# EAGLE design X15-Conversion (EAGLE 9.6.2)

## Sheet 1 of 2
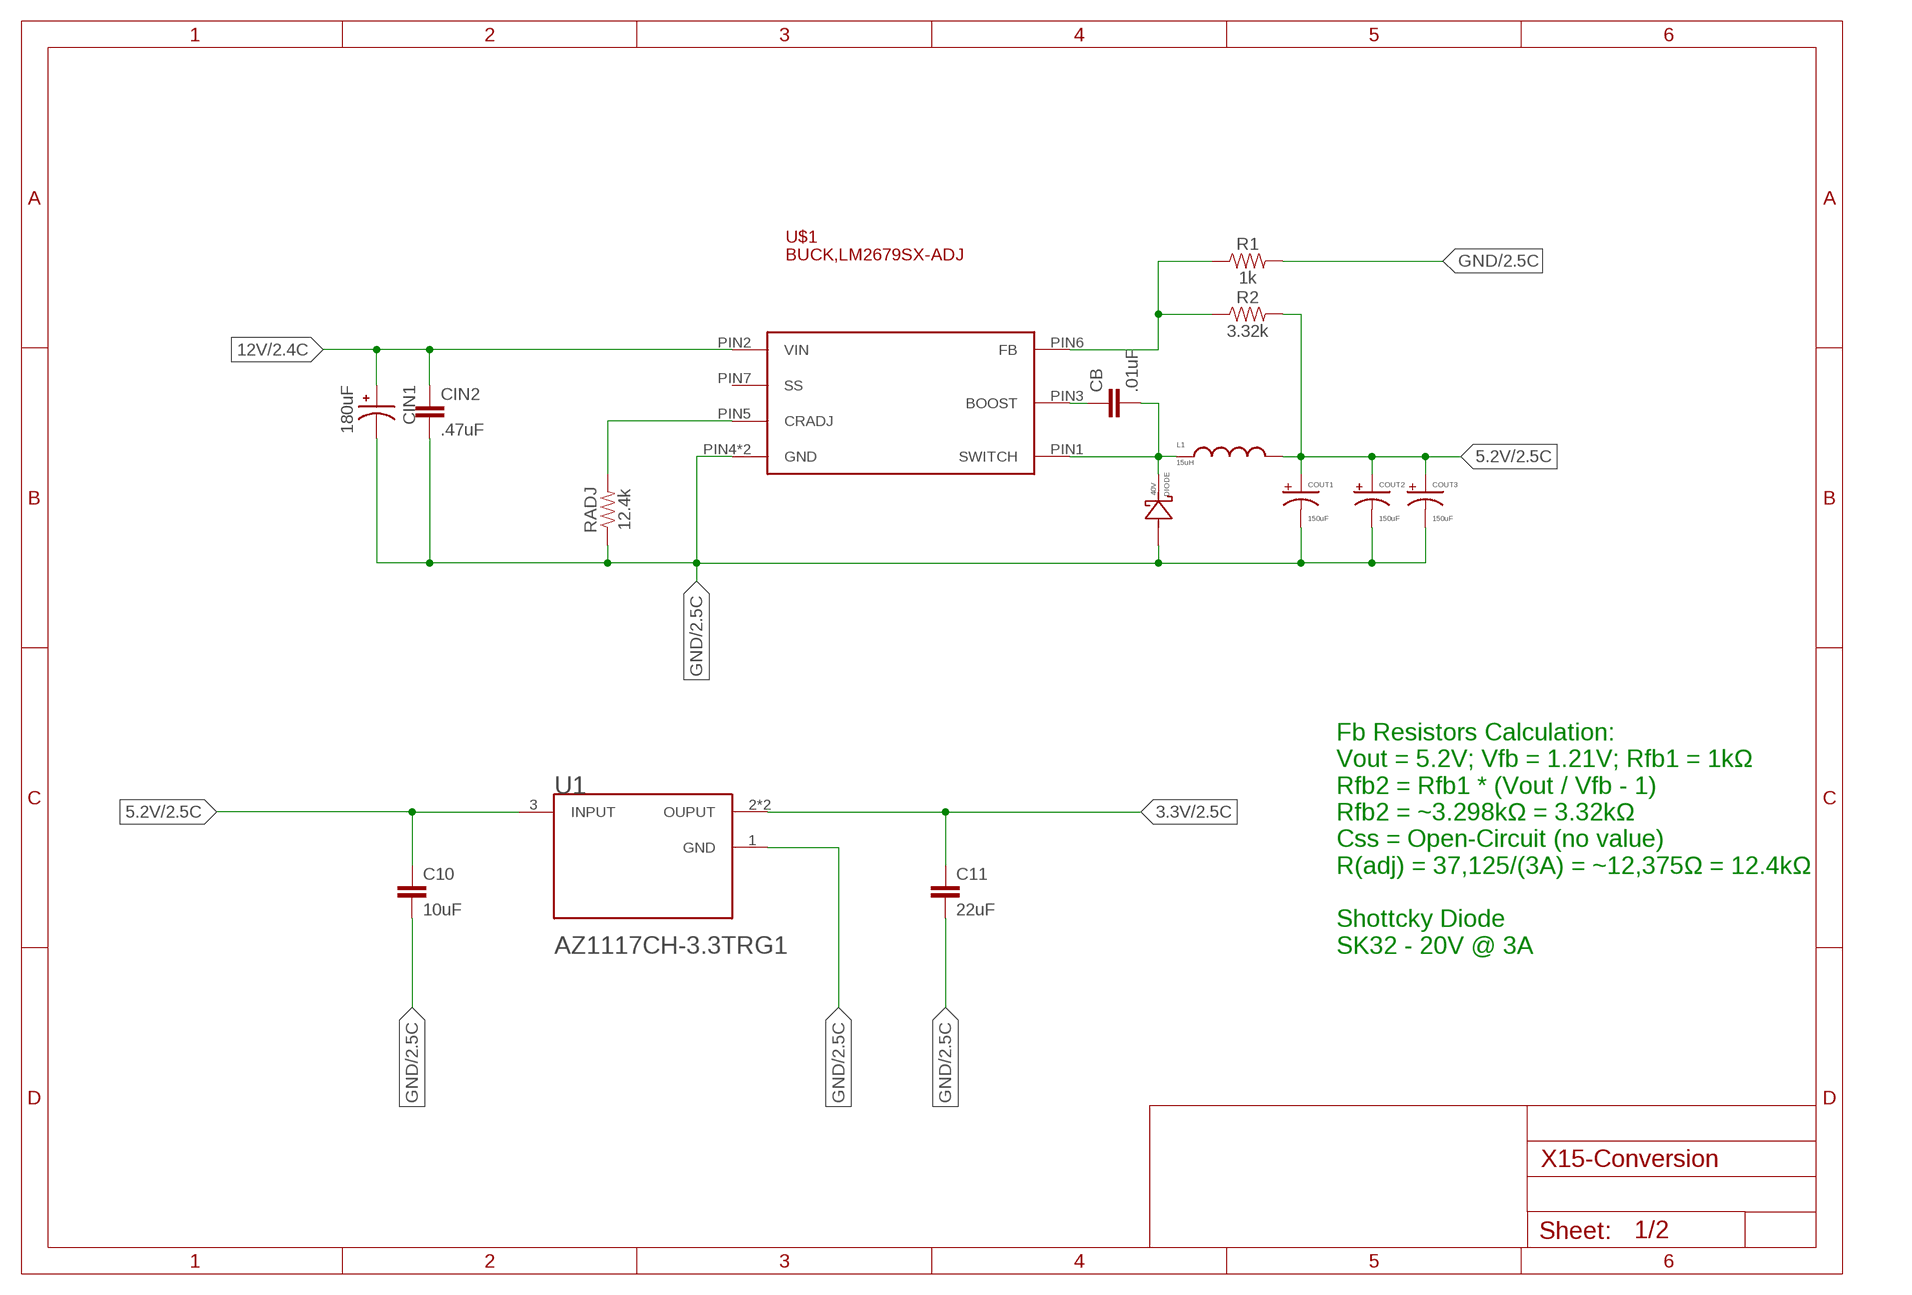
[diagram p0: schematic, sheet 1]

### Parts
C10  10uF  4.7PF-0603-50V-5%  [0603]
C11  22uF  4.7PF-0603-50V-5%  [0603]
CB  .01uF  4.7PF-0603-50V-5%  [0603]
CIN1  180uF  EEEFKE181XSP  [CAP_EEEFKE181XSP]
CIN2  .47uF  4.7PF-0603-50V-5%  [0603]
COUT1  150uF  C-TANTALUM(10UF_150UF)  [2917(7343-31-METRIC)]
COUT2  150uF  C-TANTALUM(10UF_150UF)  [2917(7343-31-METRIC)]
COUT3  150uF  C-TANTALUM(10UF_150UF)  [2917(7343-31-METRIC)]
DIODE  40V  CDBG520-G  [DO214AC]
L1  15uH  HCMA1305  [HCMA1305]
R1  1k  2.0KOHM-0603-1/10W-5%  [0603]
R2  3.32k  2.0KOHM-0603-1/10W-5%  [0603]
RADJ  12.4k  2.0KOHM-0603-1/10W-5%  [0603]
U1  LINEAR,AZ1117CR-3.3TRG1DIODES_AZ1117CH-3.3TRG1_0_0  [LINEAR,AZ1117CR-3.3TRG1]
U$1  BUCK,LM2679SX-ADJ  [BUCK,LM2679SX-ADJ]

### Nets
3.3V: C11.1 U1.2(OUPUT) U1.4(OUPUT) ; also sheet 2
5.2V: C10.1 COUT1.+ COUT2.+ COUT3.+ L1.2 R2.2 U1.3(INPUT) ; also sheet 2
12V: CIN1.1 CIN2.1 U$1.PIN2(VIN) ; also sheet 2
BOOST: CB.1 U$1.PIN3(BOOST)
CRADJ: RADJ.2 U$1.PIN5(CRADJ)
FB: R1.1 R2.1 U$1.PIN6(FB)
GND: C10.2 C11.2 CIN1.2 CIN2.2 COUT1.- COUT2.- COUT3.- DIODE.A R1.2 RADJ.1 U1.1(GND) U$1.PIN4(GND) U$1.PIN8(GND) ; also sheet 2
SWITCH: CB.2 DIODE.C L1.1 U$1.PIN1(SWITCH)
Unconnected: U$1.PIN7(SS)

### Notes on the sheet
- Fb Resistors Calculation: 
  Vout = 5.2V; Vfb = 1.21V; Rfb1 = 1kΩ 
  Rfb2 = Rfb1 * (Vout / Vfb - 1) 
  Rfb2 = ~3.298kΩ = 3.32kΩ
  Css = Open-Circuit (no value)
  R(adj) = 37,125/(3A) = ~12,375Ω = 12.4kΩ
  
  Shottcky Diode
  SK32 - 20V @ 3A

## Sheet 2 of 2
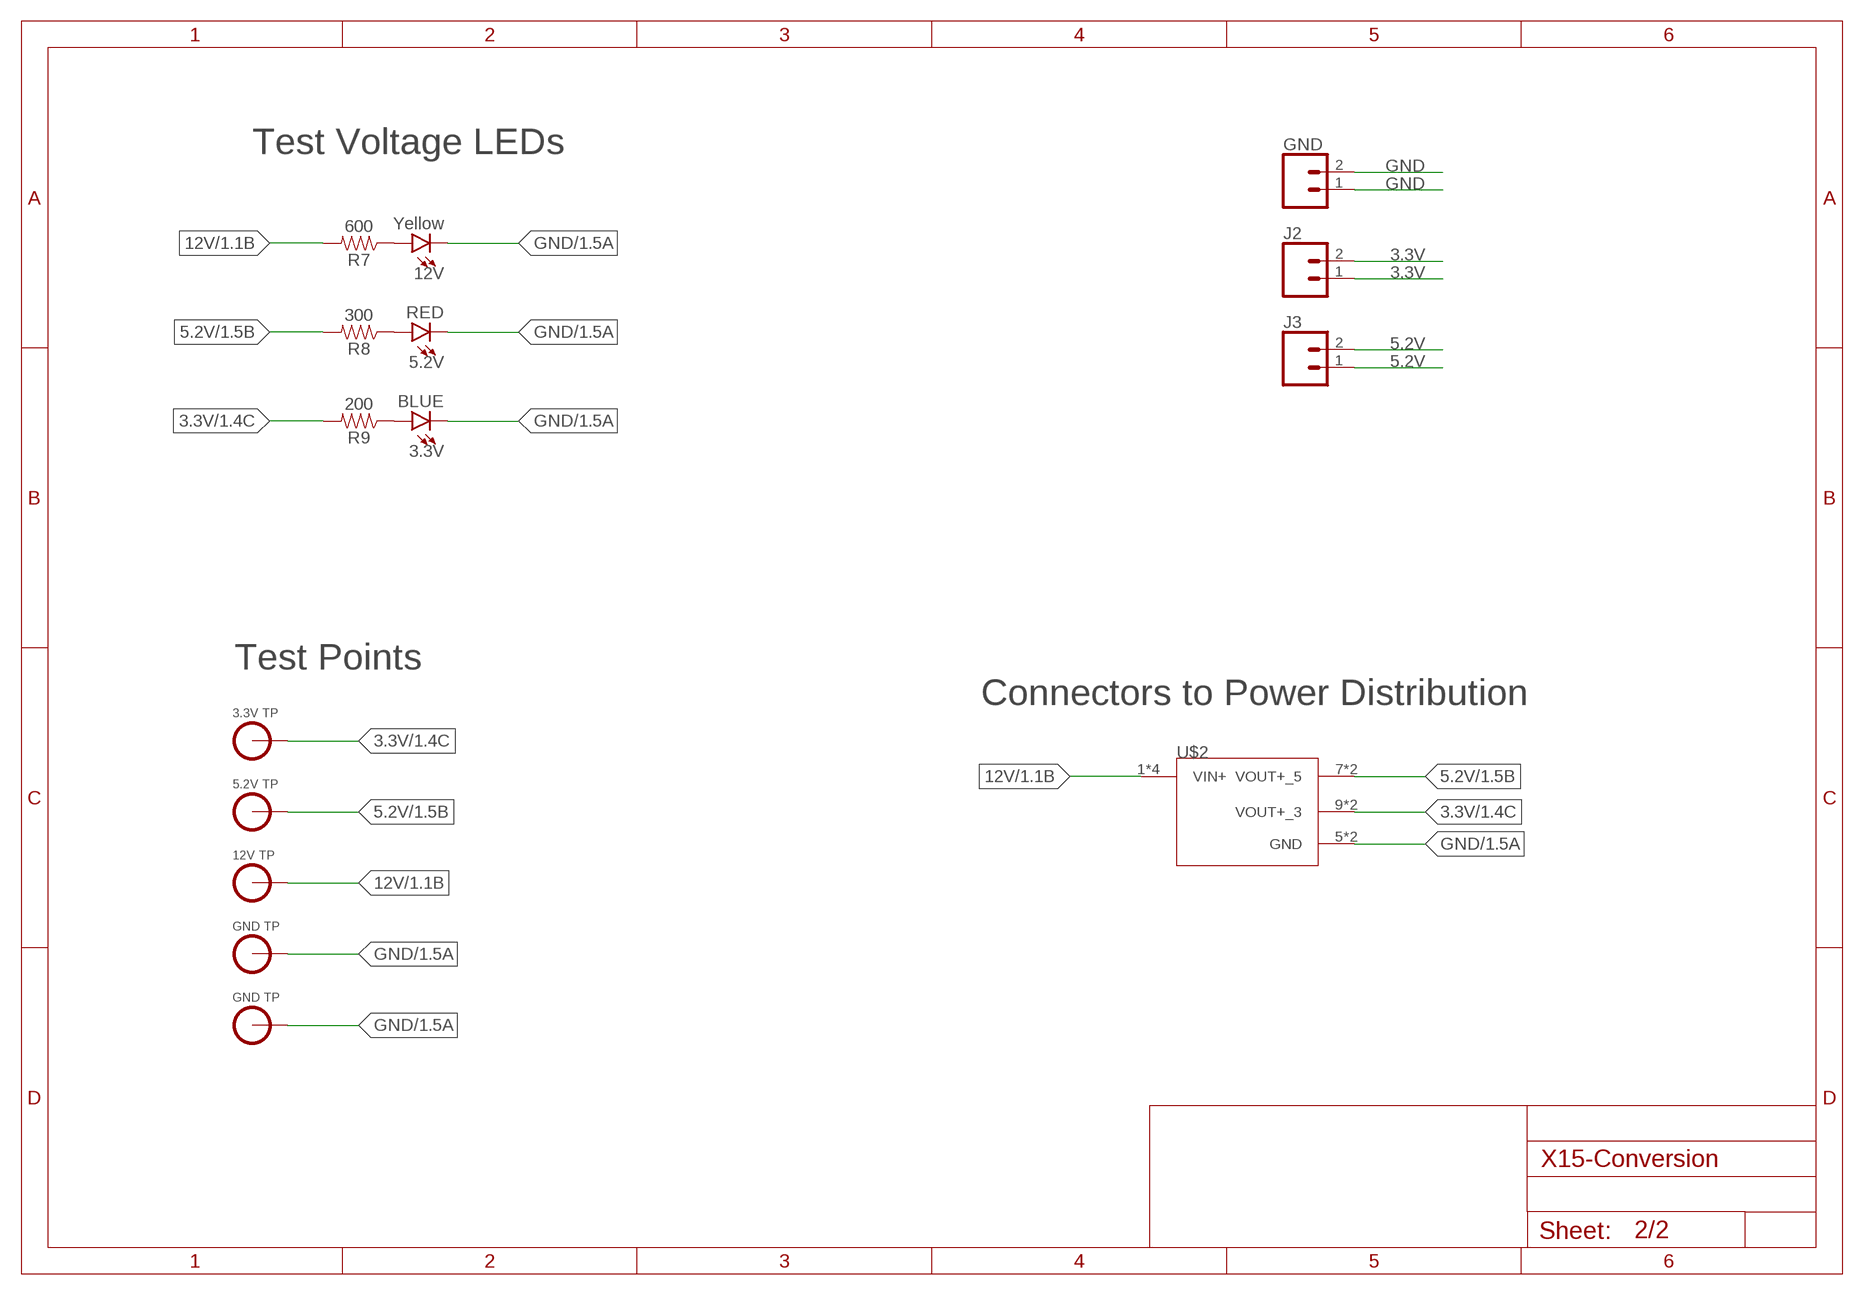
[diagram p1: schematic, sheet 2]

### Parts
3.3V  BLUE  LED-BLUE0603  [LED-0603]
5.2V  RED  LED-RED0603  [LED-0603]
12V  Yellow  LED-YELLOW0603  [LED-0603]
GND  CONN_02  [1X02]
J2  CONN_02  [1X02]
J3  CONN_02  [1X02]
R7  600  20OHM-0603-1/10W-1%  [0603]
R8  300  20OHM-0603-1/10W-1%  [0603]
R9  200  20OHM-0603-1/10W-1%  [0603]
U$2  CONVERSION-DISTRIBUTION  [TSW-105-05-G-S(C-D)]
U$8  3.3V_TESTPOINT  [3.3V_TESTPOINT]
U$9  5.2V_TESTPOINT  [5.2V_TESTPOINT]
U$10  12V_TESTPOINT  [12V_TESTPOINT]
U$11  GND_TESTPOINT  [GND_TESTPOINT]
U$12  GND_TESTPOINT  [GND_TESTPOINT]

### Nets
3.3V: J2.1 J2.2 R9.2 U$2.9(VOUT+_3) U$2.10(VOUT+_3) U$8.3.3V ; also sheet 1
5.2V: J3.1 J3.2 R8.2 U$2.7(VOUT+_5) U$2.8(VOUT+_5) U$9.5.2V ; also sheet 1
12V: R7.2 U$2.1(VIN+) U$2.2(VIN+) U$2.3(VIN+) U$2.4(VIN+) U$10.12V ; also sheet 1
GND: 3.3V.C 5.2V.C 12V.C GND.1 GND.2 U$2.5(GND) U$2.6(GND) U$11.GND U$12.GND ; also sheet 1
N$8: 12V.A R7.1
N$9: 5.2V.A R8.1
N$10: 3.3V.A R9.1

### Notes on the sheet
- Test Voltage LEDs
- Test Points
- Connectors to Power Distribution

## Library data of the parts
3.3V = SparkFun-LED:LED-BLUE: Blue SMD LED Used in manufacturing of various products at SparkFun Packages: 0603 - SMD 0603 package [Product Link] <http://www.digikey.com/product-detail/en/SMLE12BC7TT86/511-1589-2-ND/1641808> 1206 - SMD1206 package [Product Link] <http://www.digikey.com/product-detail/en/lite-on-inc/LTST-C150TBKT/160-1643-1-ND/573584> SparkFun Products: ESP8266 Thing-Dev Board <https://www.sparkfun.com/products/13711> RedBoard <https://www.sparkfun.com/products/12757>; PROD_ID: DIO-08575
5.2V = SparkFun-LED:LED-RED: Red SMD LED Used in manufacturing of most products at SparkFun Packages: 0603 - SMD 0603 package [Product Link] <http://docs.avagotech.com/docs/AV02-0551EN> 0603 SMART - SMD 0603 SMART package ( more efficient and expensive)[Product Link] <http://www.osram-os.com/Graphics/XPic2/00077099_0.pdf> 1206 - SMD1206 package [Product Link] <https://www.sparkfun.com/datasheets/DevTools/LilyPad/Q150OVS4.pdff> SparkFun Products: Pro Mini 328 -5V <https://www.sparkfun.com/products/821> RedBoard <https://www.sparkfun.com/products/12757> IOIO-OTG <https://www.sparkfun.com/products/13613>; PROD_ID: DIO-00819
12V = SparkFun-LED:LED-YELLOW: Yellow SMD LED Used in manufacturing several products at SparkFun. Packages: 0603 - SMD 0603 package[Product Link] <http://www.kingbrightusa.com/product.asp?catalog_name=LED&product_id=APT1608SYCK> 0603 -SMART - SMART SMD 0603 package (more efficient/more expensive) [Product Link] <http://www.osram-os.com/osram_os/en/products/product-catalog/led-light-emitting-diodes/smartled-0603/ly-l29k/index.jsp> LilyPad - SMD1206 package[Product Datasheet] <https://www.sparkfun.com/datasheets/DevTools/LilyPad/Q150YUS4.pdf> SparkFun Products: Blynk Board <https://www.sparkfun.com/products/13794> IOIO-OTG <https://www.sparkfun.com/products/13613> XBee Explorer Serial <https://www.sparkfun.com/products/13225>; PROD_ID: DIO-09003
C10 C11 CB CIN2 = SparkFun-Capacitors:4.7PF: 4.7pF ceramic capacitors A capacitor is a passive two-terminal electrical component used to store electrical energy temporarily in an electric field.; PROD_ID: CAP-07880; VALUE: 4.7pF
CIN1 = X15-Conversion-Parts-Library:EEEFKE181XSP; DESCRIPTION: 180µF 25V Aluminum Electrolytic Capacitors Radial, Can - SMD 340mOhm @ 100kHz 2000 Hrs @ 105°C; DIGI-KEY_PART_NUMBER: P18956TR-ND; MF: Panasonic; MP: EEEFKE181XSP; PACKAGE: RADIAL-2 Panasonic
COUT1-COUT3 = X15-Conversion-Parts-Library:C-TANTALUM(10UF_150UF)
DIODE = X15-Conversion-Parts-Library:CDBG520-G
GND J2 J3 = SparkFun-Connectors:CONN_02: Multi connection point. Often used as Generic Header-pin footprint for 0.1 inch spaced/style header connections On any of the 0.1 inch spaced packages, you can populate with these: Break Away Headers - Straight <https://www.sparkfun.com/products/116> (PRT-00116) Break Away Male Headers - Right Angle <https://www.sparkfun.com/products/553> (PRT-00553) Female Headers <https://www.sparkfun.com/products/115> (PRT-00115) Break Away Headers - Machine Pin <https://www.sparkfun.com/products/117> (PRT-00117) Break Away Female Headers - Swiss Machine Pin <https://www.sparkfun.com/products/743> (PRT-00743) For SCREWTERMINALS and SPRING TERMINALS visit here: Screw Terimnals on SparkFun.com <https://www.sparkfun.com/search/results?term=Screw+Terminals> (5mm/3.5mm/2.54mm spacing) This device is also useful as a general connection point to wire up your design to another part of your project. Our various solder wires solder well into these plated through hole pads. Hook-Up Wire - Assortment (Stranded, 22 AWG) <https://www.sparkfun.com/products/11375> (PRT-11375) Hook-Up Wire - Assortment (Solid Core, 22 AWG) <https://www.sparkfun.com/products/11367> (PRT-11367) View the entire wire category on our website here <https://www.sparkfun.com/categories/141> Special notes: Molex polarized connector foot print use with: PRT-08233 with associated crimp pins and housings. 2.54_SCREWTERM for use with PRT-10571. 3.5mm Screw Terminal footprints for PRT-08084 5mm Screw Terminal footprints for use with PRT-08432
L1 = X15-Conversion-Parts-Library:HCMA1305: Eaton HCMA1305-150-R Inductor
R1 R2 RADJ = SparkFun-Resistors:2.0KOHM: 2kΩ resistor A resistor is a passive two-terminal electrical component that implements electrical resistance as a circuit element. Resistors act to reduce current flow, and, at the same time, act to lower voltage levels within circuits. - Wikipedia; PROD_ID: RES-08296; VALUE: 2.0k
R7-R9 = SparkFun-Resistors:20OHM: RES-07862; PROD_ID: RES-07862; VALUE: 20
U1 = X15-Conversion-Parts-Library:LINEAR,AZ1117CR-3.3TRG1: 1.35A 3.3V LDO Reg. Current Limit SOT223 Check availability <https://pricing.snapeda.com/parts/AZ1117CH-3.3TRG1/Diodes%20Inc./view-part?ref=eda>; AVAILABILITY: In Stock; DESCRIPTION: Linear Voltage Regulator IC Positive Fixed 1 Output 1A SOT-223-3; MF: Diodes Inc.; MP: AZ1117CH-3.3TRG1; PACKAGE: SOT-223 Diodes Inc.; PRICE: None; PURCHASE-URL: https://pricing.snapeda.com/search/part/AZ1117CH-3.3TRG1/?ref=eda
U$1 = X15-Conversion-Parts-Library:BUCK,LM2679SX-ADJ
U$2 = X15-Conversion-Parts-Library:CONVERSION-DISTRIBUTION
U$8 = X15-Conversion-Parts-Library:3.3V_TESTPOINT
U$9 = X15-Conversion-Parts-Library:5.2V_TESTPOINT
U$10 = X15-Conversion-Parts-Library:12V_TESTPOINT
U$11 U$12 = X15-Conversion-Parts-Library:GND_TESTPOINT

## Board
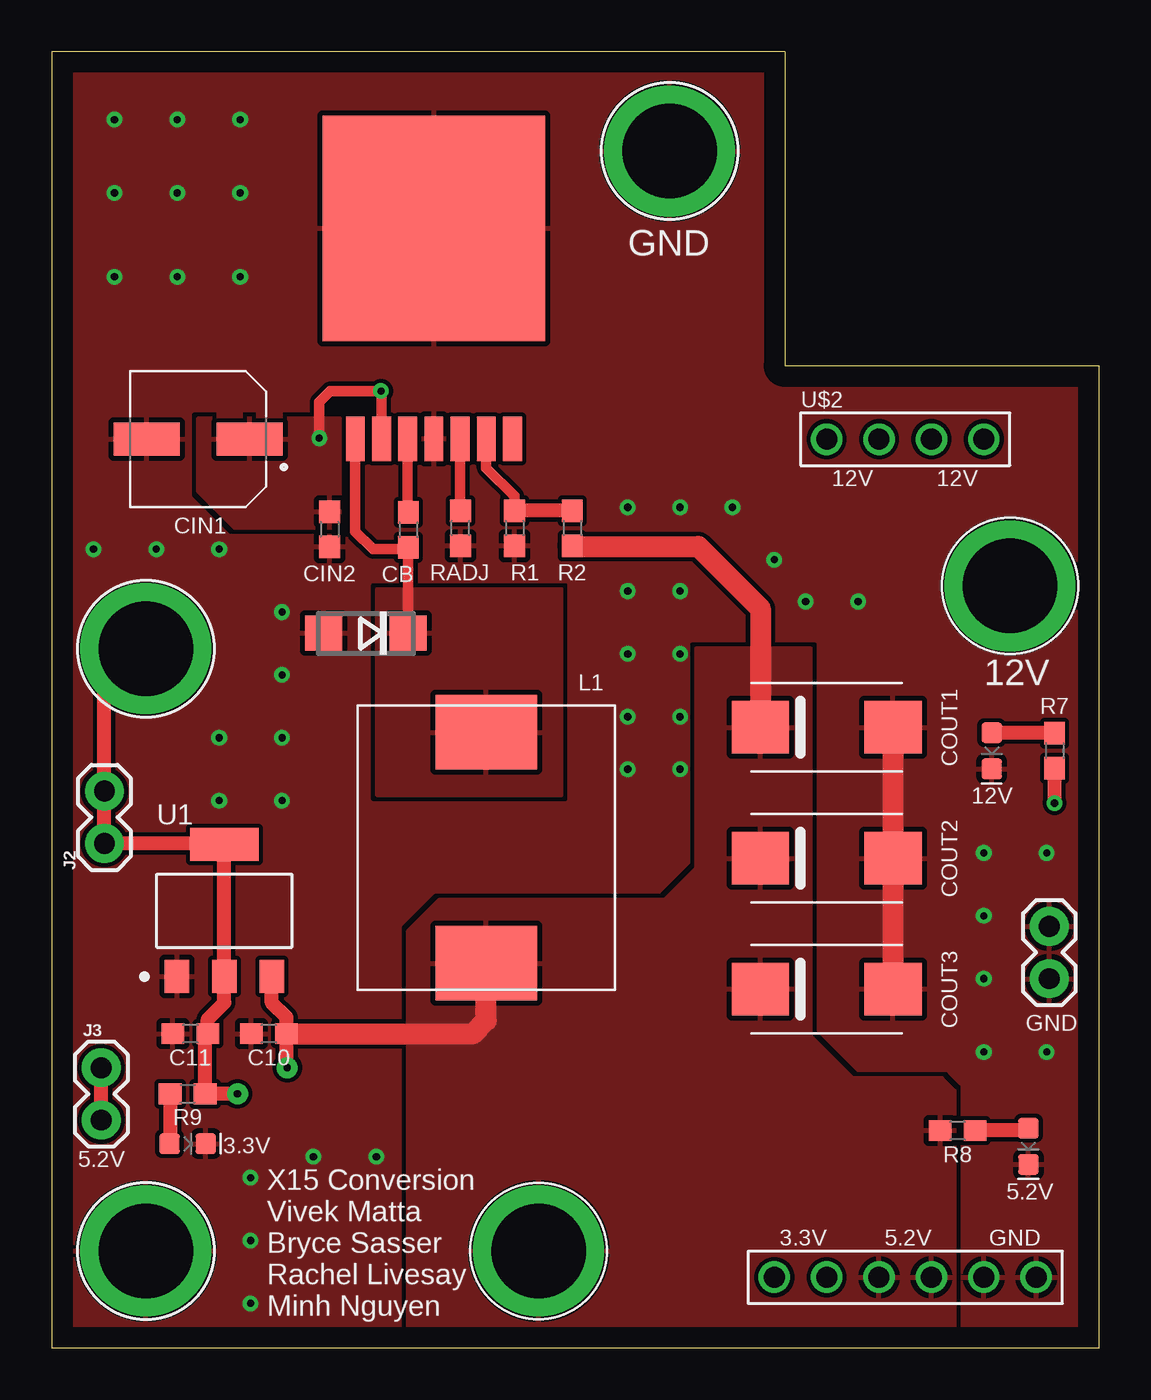
[diagram p2: board, top side]
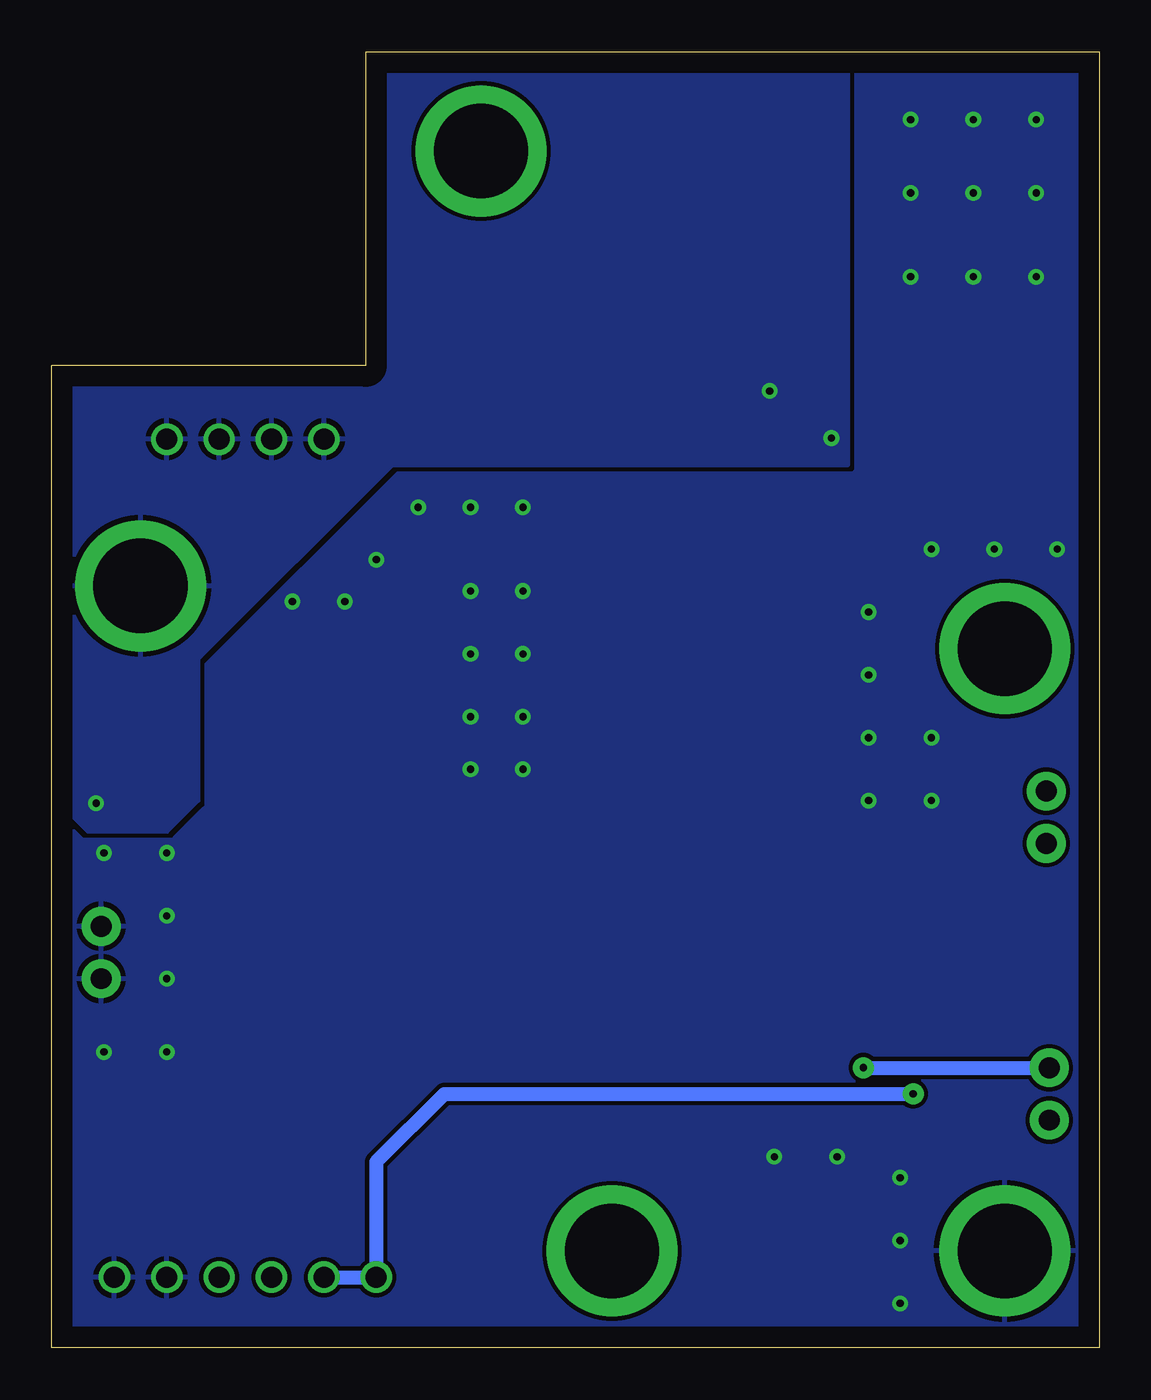
[diagram p3: board, bottom side, seen from below]

Size 50.8 x 62.87 mm. Coordinates in mm from the lower left corner, seen from the top.
Outline: 0,0 50.8,0 50.8,47.62 35.56,47.62 35.56,62.87 0,62.87 0,0
Copper layers (1*16): Top 0.035mm / dielectric 1.5mm / Bottom 0.035mm
Design rules "477": minimum track width 6mil, minimum drill 0.35mm, track to track 6mil, track to pad 6mil, pad to pad 6mil, via to via 6mil, smd to smd 6mil, copper to edge 40mil, drill to drill 6mil, minimum pad ring 10mil, minimum via ring 8mil, stop-mask expansion 4mil, vias tented up to drill 0mil, thermal gap 10mil

### Footprints (pad centres in the part's own frame; a part is rotated, then mirrored left to right if it is on the bottom)
LED-0603 = smd 1 x 1: A -0.877,0; C 0.877,0
0603 = smd 1.1 x 1: 1 -0.85,0; 2 0.85,0
CAP_EEEFKE181XSP = smd 3.2 x 1.6: 1 -2.5,0; 2 2.5,0
2917(7343-31-METRIC) = smd 2.77 x 2.55: + -3.22,0; - 3.22,0
DO214AC = smd 1.8 x 1.7: A 2.05,0; C -2.05,0
1X02 = drill 1.016 pad 1.88: 1 0,0; 2 2.54,0
HCMA1305 = smd 3.6 x 4.9: 1 -5.6,0; 2 5.6,0
LINEAR,AZ1117CR-3.3TRG1 = smd 1.2 x 1.6: 1 -2.3,-3.2; 2 0,-3.2; 3 2.3,-3.2 | smd 3.3 x 1.6: 4 0,3.2
BUCK,LM2679SX-ADJ = smd 2.16 x 0.91: PIN1 0,-7.62; PIN2 0,-6.35; PIN3 0,-5.08; PIN4 0,-3.81; PIN5 0,-2.54; PIN6 0,-1.27; PIN7 0,0 | smd 10.918 x 10.8: PIN8 -10.195,-3.81
TSW-105-05-G-S(C-D) = drill 1.016: 1 3.81,20.32; 2 1.27,20.32; 3 -1.27,20.32; 4 -3.81,20.32; 5 6.35,-20.32; 6 3.81,-20.32; 7 1.27,-20.32; 8 -1.27,-20.32; 9 -3.81,-20.32; 10 -6.35,-20.32
3.3V_TESTPOINT = drill 4.572 pad 6.35: 3.3V 0,0
5.2V_TESTPOINT = drill 4.572 pad 6.35: 5.2V 0,0
12V_TESTPOINT = drill 4.572 pad 6.35: 12V 0,0
GND_TESTPOINT = drill 4.572 pad 6.35: GND 0,0

### Placement (x,y rotation side)
3.3V  6.6,9.91 0 top
5.2V  47.37,9.78 270 top
12V  45.59,28.96 270 top
C10  10.54,15.24 180 top
C11  6.73,15.24 180 top
CB  17.3,39.67 270 top
CIN1  7.11,44.07 180 top
CIN2  13.49,39.7 270 top
COUT1  37.59,30.1 0 top
COUT2  37.59,23.75 0 top
COUT3  37.59,17.4 0 top
DIODE  15.24,34.67 180 top
GND  48.39,17.91 90 top
J2  2.57,24.46 90 top
J3  2.41,11.05 90 top
L1  21.08,24.26 270 top
R1  22.45,39.75 270 top
R2  25.25,39.75 270 top
R7  48.64,28.96 270 top
R8  43.94,10.54 180 top
R9  6.6,12.32 0 top
RADJ  19.84,39.75 90 top
U1  8.38,21.21 0 top
U$1  22.35,44.09 270 top
U$2  41.4,23.75 0 top
U$8  4.57,33.91 0 top
U$9  23.62,4.7 0 top
U$10  46.48,36.96 90 top
U$11  4.57,4.7 0 top
U$12  29.97,58.04 0 top

### Tracks (layer width: path | path; a pad name or v marks a point on that pad's centre or on a via)
3.3V  (via drill 0.35 pad 1.02)
  Top 0.686: v9.02,12.32 R9.2 7.45,15.11 C11.1 7.58,15.94 8.38,16.74 U1.2 U1.4 8.33,24.46 J2.1 J2.2 2.56,31.9 U$8.3.3V
  Bottom 0.686: v9.02,12.32 31.75,12.32 35.05,9.02 U$2.10 U$2.9
5.2V  (via drill 0.35 pad 1.02)
  Top 0.686: U1.3 10.68,16.74 11.39,16.03 C10.1 11.39,13.63 v11.43,13.59 | 20.96,18.54 L1.2 | J3.1 J3.2
  Top 1.016: R2.2 25.29,38.86 31.37,38.86 34.37,35.86 COUT1.+ | 20.96,18.54 21.08,18.41 21.08,15.88 20.45,15.24 C10.1
  Bottom 0.686: v11.43,13.59 J3.2
  pour Top (isolate 0.203): 31.24,33.91 31.24,23.24 29.72,21.72 18.8,21.72 17.27,20.19 17.27,0.89 43.81,0.89 43.81,12.45 43.18,13.08 38.86,13.08 36.83,15.11 36.83,33.91
12V  (via drill 0.35)
  Top 0.508: U$1.PIN2 16,46.38 v15.98,46.41 13.51,46.41 12.98,45.87 v12.98,44.12
  Top 0.686: R7.2 v48.64,26.42
  pour Bottom (isolate 0.203): 12.19,62.61 12.19,42.8 34.29,42.8 43.69,33.4 43.69,26.54 45.21,25.02 49.02,25.02 50.29,26.29 50.29,47.37 35.31,47.37 35.31,62.61
  pour Top (isolate 0.203): 7.11,45.09 13.97,45.09 13.97,39.75 8.89,39.75 7.11,41.53
BOOST
  Top 0.508: U$1.PIN3 17.27,40.55 CB.1
CRADJ
  Top 0.508: U$1.PIN5 19.81,40.63 RADJ.2
FB
  Top 0.508: R1.1 22.45,41.3 21.08,42.67 U$1.PIN6
  Top 0.686: R2.1 R1.1
GND  (via drill 0.35)
  Top 1.016: COUT1.- COUT2.- COUT3.-
  other vias: 27.94,40.77 30.48,40.77 33.02,40.77 35.05,38.23 36.58,36.2 39.12,36.2 27.94,36.7 30.48,36.7 30.48,33.66 27.94,33.66 27.94,30.61 30.48,30.61 27.94,28.07 30.48,28.07 11.18,35.69 11.18,32.64 11.18,29.59 11.18,26.54 8.13,29.59 8.13,26.54 9.65,8.25 9.65,5.21 9.65,2.16 12.7,9.27 15.75,9.27 8.13,38.73 5.08,38.73 2.03,38.73 48.26,14.35 45.21,14.35 45.21,17.91 45.21,20.95 45.21,24 48.26,24 3.05,59.56 3.05,56.01 3.05,51.94 9.14,56.01 6.1,59.56 9.14,59.56 6.1,56.01 6.1,51.94 9.14,51.94
  pour Top (isolate 0.203, rank 6): 37.59,64.39 37.59,60.58 45.21,60.58 56.64,49.15 56.64,2.16 51.56,-2.92 -4.32,-2.92 -4.32,61.85 -1.78,64.39
  pour Bottom (isolate 0.203, rank 6): -5.59,68.2 45.21,68.2 55.37,58.04 61.72,51.69 61.72,-4.19 55.37,-10.54 42.67,-10.54 -1.78,-10.54 -10.67,-1.65 -10.67,63.12
N$8
  Top 0.686: 12V.A 48.61,29.83 R7.1
N$9
  Top 0.686: 5.2V.A 47.26,10.54 R8.1
N$10
  Top 0.686: R9.1 5.75,9.93 3.3V.A
SWITCH
  Top 0.508: U$1.PIN1 14.73,39.6 15.6,38.73 17.21,38.73 CB.2 DIODE.C
  pour Top (isolate 0.203): 15.8,36.8 24.71,36.8 24.71,26.8 15.8,26.8

### Text on the board
tPlace: X15 Conversion / Vivek Matta / Bryce Sasser / Rachel Livesay / Minh Nguyen
tNames: GND | 12V | 12V | 12V | 5.2V | 3.3V | 5.2V | GND